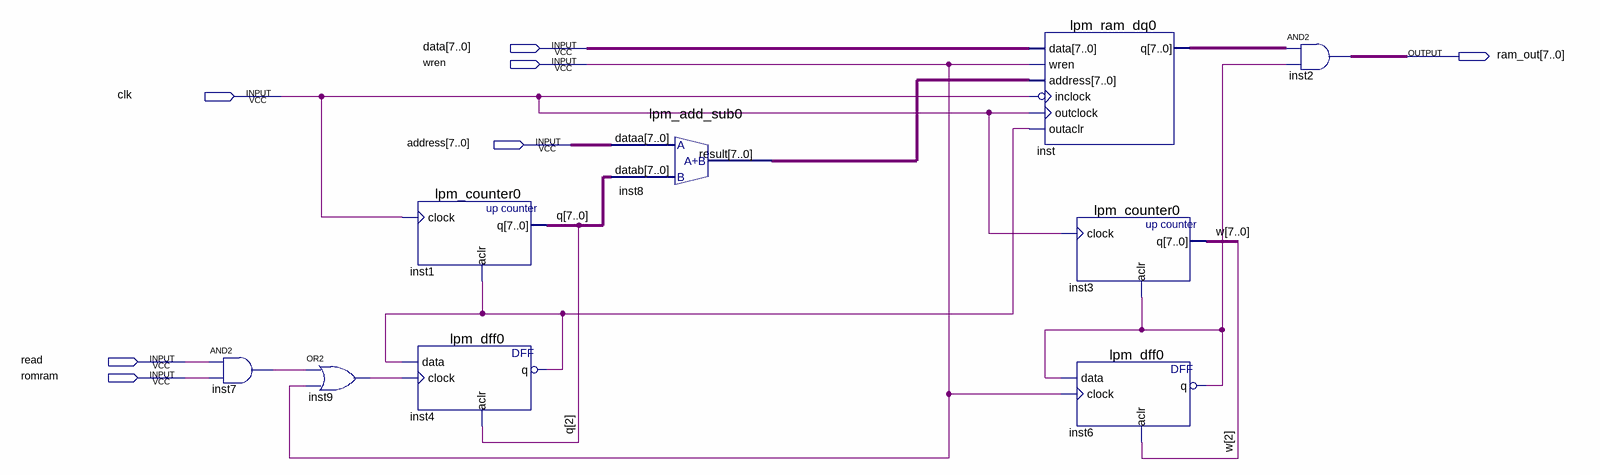
[diagram p0: schematic sheet]
// Quartus schematic ram.bdf as structural Verilog: 9 symbols, 7 pins
module ram (
  input  [7:0] data,
  input  wren,
  input  clk,
  input  [7:0] address,
  input  read,
  input  romram,
  output [7:0] ram_out
);

  wire inst4_q, inst4_q_inverted_out, inst6_q, inst6_q_inverted_out, inst7_out, inst9_out;
  wire [7:0] inst8_result, inst_q, q, w;

  and inst7 (inst7_out, read, romram);
  or inst9 (inst9_out, inst7_out, wren);
  lpm_counter0 inst1 (.clock(clk), .aclr(inst4_q_inverted_out), .q(q));
  lpm_dff0 inst4 (.data(inst4_q_inverted_out), .clock(inst9_out), .aclr(q[2]), .q(inst4_q));
  not inst4_q_inverted (inst4_q_inverted_out, inst4_q);
  lpm_add_sub0 inst8 (.dataa(address), .datab(q), .result(inst8_result));
  lpm_ram_dq0 inst (
    .data(data), .wren(wren), .address(inst8_result), .inclock(~clk), .outclock(clk),
    .outaclr(inst4_q_inverted_out), .q(inst_q));
  lpm_counter0 inst3 (.clock(clk), .aclr(inst6_q_inverted_out), .q(w));
  lpm_dff0 inst6 (.data(inst6_q_inverted_out), .clock(wren), .aclr(w[2]), .q(inst6_q));
  not inst6_q_inverted (inst6_q_inverted_out, inst6_q);
  assign ram_out = inst_q & {8{inst6_q_inverted_out}};  // AND2 inst2, 8 bits wide
endmodule
